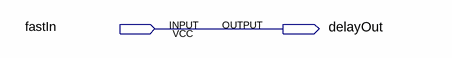
[diagram p0: schematic sheet]
// Quartus schematic delay.bdf as structural Verilog: 0 symbols, 2 pins
module delay (
  input  fastIn,
  output delayOut
);


  assign delayOut = fastIn;
endmodule
